# EAGLE schematic sch (EAGLE 7.4.0)
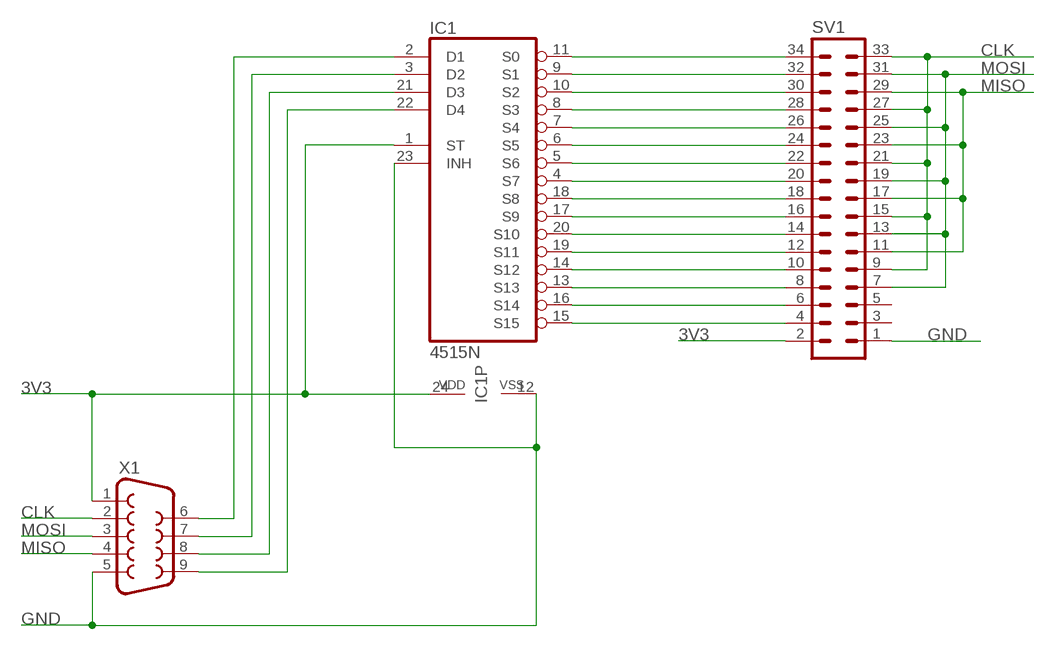
[diagram p0: schematic, sheet 1]

## Parts
IC1  4515N  [DIL24-6]
SV1  MA17-2  [MA17-2]
X1  F09VB  [F09VB]

## Nets
3V3: IC1.1(ST) IC1.24(VDD) SV1.2 X1.1
CLK: SV1.9 SV1.15 SV1.21 SV1.27 SV1.33 X1.2
GND: IC1.12(VSS) IC1.23(INH) SV1.1 X1.5
MISO: SV1.11 SV1.17 SV1.23 SV1.29 X1.4
MOSI: SV1.7 SV1.13 SV1.19 SV1.25 SV1.31 X1.3
N$3: IC1.2(D1) X1.6
N$4: IC1.3(D2) X1.7
N$5: IC1.21(D3) X1.8
N$6: IC1.22(D4) X1.9
N$7: IC1.15(S15) SV1.4
N$8: IC1.11(S0) SV1.34
N$9: IC1.9(S1) SV1.32
N$10: IC1.10(S2) SV1.30
N$11: IC1.8(S3) SV1.28
N$12: IC1.7(S4) SV1.26
N$13: IC1.6(S5) SV1.24
N$14: IC1.5(S6) SV1.22
N$15: IC1.4(S7) SV1.20
N$16: IC1.18(S8) SV1.18
N$17: IC1.17(S9) SV1.16
N$18: IC1.20(S10) SV1.14
N$19: IC1.19(S11) SV1.12
N$20: IC1.14(S12) SV1.10
N$21: IC1.13(S13) SV1.8
N$22: IC1.16(S14) SV1.6
Unconnected: SV1.3 SV1.5

## Library data of the parts
IC1 = 45xx:4515: 4-bit latch 4-16 line DECODER
SV1 = con-lstb:MA17-2: PIN HEADER; OC_FARNELL: unknown; OC_NEWARK: unknown
X1 = con-subd:F09: SUB-D; OC_FARNELL: unknown; OC_NEWARK: unknown